# Altium schematic sheet spi_led.SchDoc: SPI LED Driver
size A; Organization: UCLA HEP; DocumentNumber: 7; Revision: 2.0; SheetNumber: 7; SheetTotal: 14
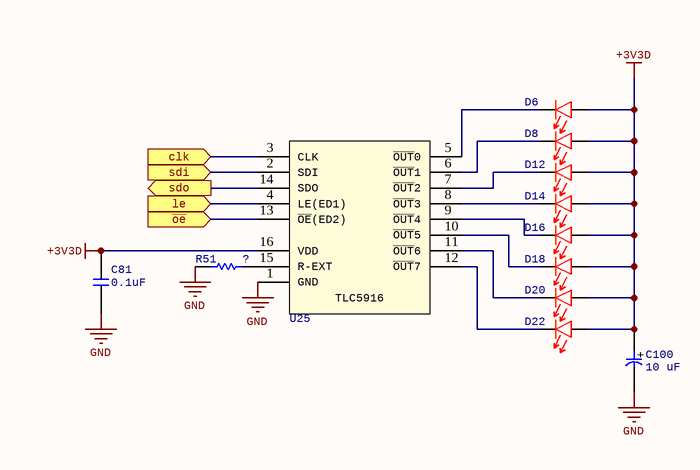
[diagram p0: spi_led.SchDoc]

## Parts
C81  0.1uF  [C0603]
C100  10 uF  [KEMET 1206]
D6  Vishay/TLMS1000-GS08  [LED0603]  (value not drawn)
D8  Vishay/TLMS1000-GS08  [LED0603]  (value not drawn)
D12  Vishay/TLMS1000-GS08  [LED0603]  (value not drawn)
D14  Vishay/TLMS1000-GS08  [LED0603]  (value not drawn)
D16  Vishay/TLMS1000-GS08  [LED0603]  (value not drawn)
D18  Vishay/TLMS1000-GS08  [LED0603]  (value not drawn)
D20  Vishay/TLMS1000-GS08  [LED0603]  (value not drawn)
D22  Vishay/TLMS1000-GS08  [LED0603]  (value not drawn)
R51  ?  [R0805]
U25  TLC5916IPWR  [TSSOP-16]  (value not drawn)

## Ports
clk (in), le (in), sdi (in), sdo (out), ~{oe} (in)

## Nets
+3V3D: C81.2 C100.1(+) D6.A D8.A D12.A D14.A D16.A D18.A D20.A D22.A U25.16(VDD)
GND: C81.1 C100.2(-) R51.1 U25.1(GND)
clk: U25.3(CLK) ; port clk
le: U25.4(LE(ED1)) ; port le
~{oe}: U25.13(~{OE}(ED2)) ; port ~{oe}
sdi: U25.2(SDI) ; port sdi
sdo: U25.14(SDO) ; port sdo
NetD6_C: D6.C U25.5(~{OUT}0)
NetD8_C: D8.C U25.6(~{OUT}1)
NetD12_C: D12.C U25.7(~{OUT}2)
NetD14_C: D14.C U25.8(~{OUT}3)
NetD16_C: D16.C U25.9(~{OUT}4)
NetD18_C: D18.C U25.10(~{OUT}5)
NetD20_C: D20.C U25.11(~{OUT}6)
NetD22_C: D22.C U25.12(~{OUT}7)
NetR51_2: R51.2 U25.15(R-EXT)

## Notes on the sheet
- Size:
- A
- Revision:
- Date:
- Sheet
- of
- (in symbol TI/TLC5916IPWR TSSOP-16) TLC5916

## Library data of the parts
C81 = VJ0603Y104KXXAC00: CAP2, CER, 0.1uF, 10%, 25V, 0603
C100 = Kemet/T491A106K010AT: CAP2, TANT,  10uF, 10%, 10V, 1206; Manufacturer: Kemet; Manufacturer Size Code: A; Capacitance: 10µF; ESR (Equivalent Series Resistance): 3.8 Ohm; Type: Molded; Lifetime @ Temp.: 2000 Hrs @ 85°C; Supplier 1: Newark; Manufacturer Part Number: T491A106K010AT; RoHS: RoHS Compliant; Category: Capacitors; Packaging: Cut Tape (CT); Tolerance: ±10%; Voltage - Rated: 10V; Mounting Type: Surface Mount; Operating Temperature: -55°C ~ 125°C; Package / Case: 1206 (3216 Metric); Size / Dimension: 0.126" L x 0.063" W (3.20mm x 1.60mm); Height - Seated (Max): 0.071" (1.80mm); Lead Spacing: -; Features: General Purpose; ComponentLink1URL: http://www.kemet.com/Lists/ProductCatalog/Attachments/254/KEM_T2005_T491.pdf; ComponentLink1Description: http://www.kemet.com/Lists/ProductCatalog/Attachments/254/KEM_T2005_T491.pdf; Supplier Part Number 1: 57K1635; Stock 2: 145394; Pricing 2: 1=0.38, 10=0.337, 50=0.2044, 100=0.1684, 250=0.13468, 500=0.12266, 1000=0.11063 (USD); Supplier 2: Digi-Key; Supplier Part Number 2: 399-3684-6-ND; Supplier 3: Digi-Key; Supplier Part Number 3: 399-3684-1-ND
D6 D8 D12 D14 D16 D18 D20 D22 = Vishay/TLMS1000-GS08: LED, 2mA, 0603, Red
R51 = RES SMD ? OHM 1% 1/10W 0805: Placeholder
U25 = TI/TLC5916IPWR TSSOP-16: LED, Driver, 120mA, 16-TSSOP; Manufacturer: TEXAS INSTRUMENTS; Device Topology: Constant Current; No. of Outputs: 8; Output Current: 120; Output Voltage: 17; Driver Case Style: TSSOP; No. of Pins: 16; Input Voltage Min: 3; Input Voltage Max: 5.5; Supplier 1: Newark; Manufacturer Part Number: TLC5916IPWR; RoHS: YES; Stock 1: 1764; Pricing 1: 1=1.63, 10=1.3, 100=0.997, 1000=0.696 (USD); ComponentLink1URL: http://www.farnell.com/datasheets/1705047.pdf; ComponentLink1Description: http://www.farnell.com/datasheets/1705047.pdf; Supplier Part Number 1: 86W6261